# Altium schematic sheet Offset.V03.R00.SchDoc: Agregado de Offset a Canal X
size A4; SheetNumber: 7; SheetTotal: 18
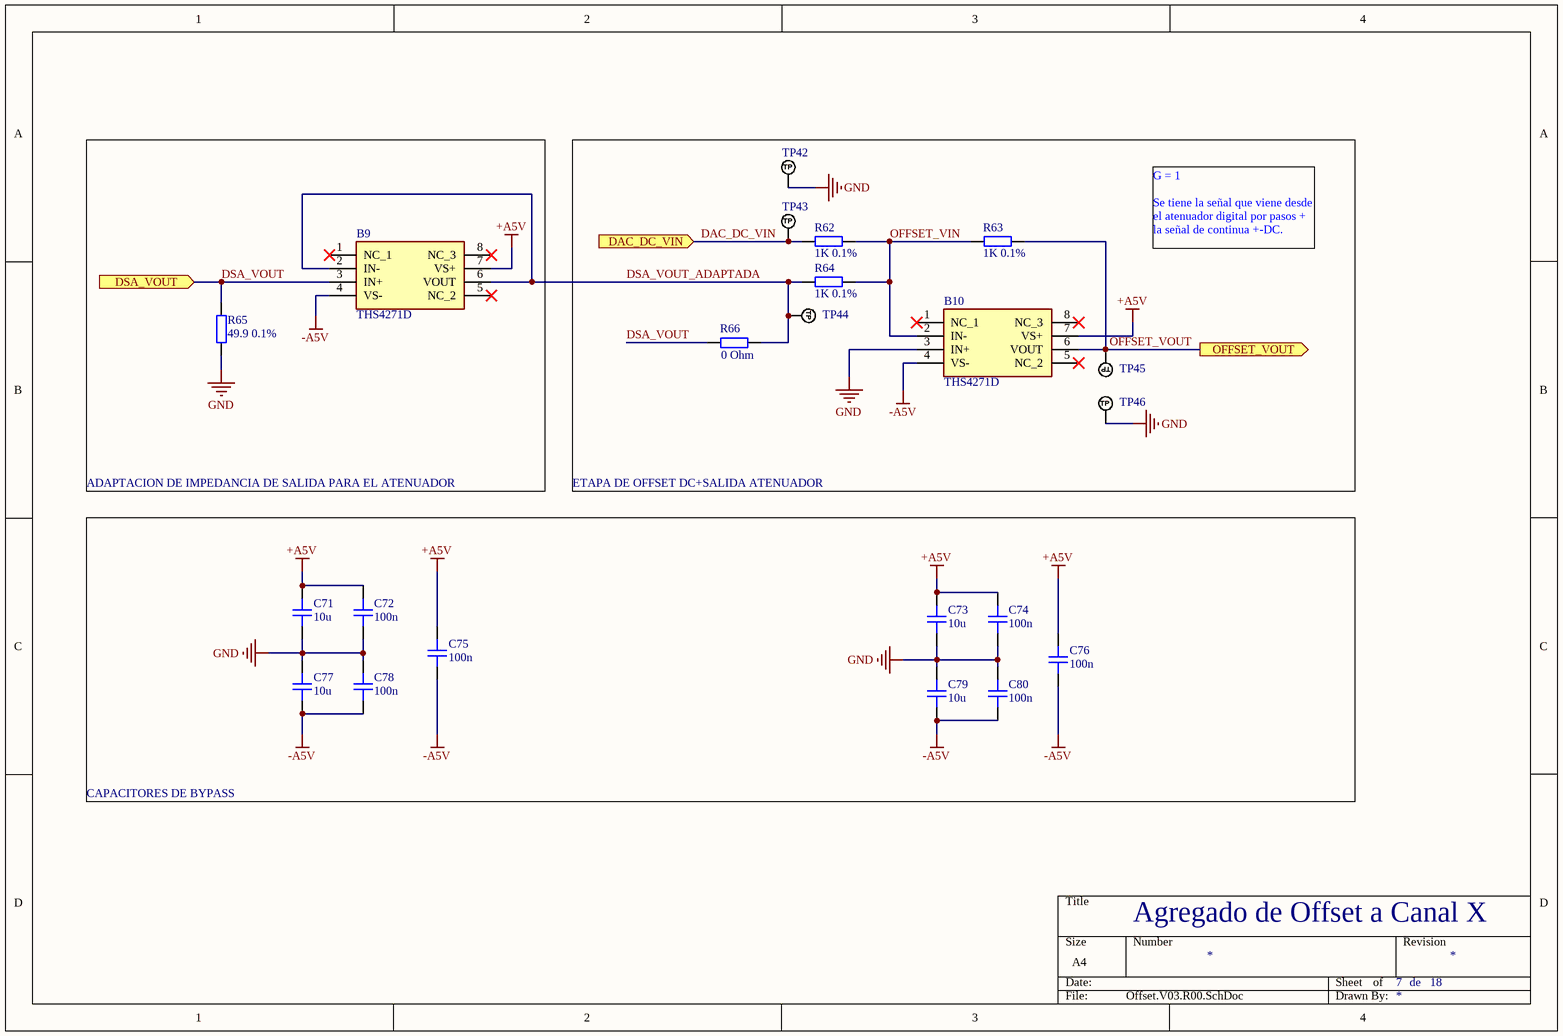
[diagram p0: Offset.V03.R00.SchDoc]

## Parts
B9  THS4271D  [SOIC127P600X175-8N]
B10  THS4271D  [SOIC127P600X175-8N]
C71  10u  [CAP_0805]
C72  100n  [CAP_0805]
C73  10u  [CAP_0805]
C74  100n  [CAP_0805]
C75  100n  [CAP_0805]
C76  100n  [CAP_0805]
C77  10u  [CAP_0805]
C78  100n  [CAP_0805]
C79  10u  [CAP_0805]
C80  100n  [CAP_0805]
R62  1K 0.1%  [RES_0805]
R63  1K 0.1%  [RES_0805]
R64  1K 0.1%  [RES_0805]
R65  49.9 0.1%  [RES_0805]
R66  0 Ohm  [RES_0805]
TP42  TP_NOBOM  [PAD_RND_1MM]  (value not drawn)  (no BOM)
TP43  TP_NOBOM  [PAD_RND_1MM]  (value not drawn)  (no BOM)
TP44  TP_NOBOM  [PAD_RND_1MM]  (value not drawn)  (no BOM)
TP45  TP_NOBOM  [PAD_RND_1MM]  (value not drawn)  (no BOM)
TP46  TP_NOBOM  [PAD_RND_1MM]  (value not drawn)  (no BOM)

## Blocks framed on the sheet
ADAPTACION DE IMPEDANCIA DE SALIDA PARA EL ATENUADOR: B9 R65
ETAPA DE OFFSET DC+SALIDA ATENUADOR: B10 R62-R64 R66 TP42-TP46
CAPACITORES DE BYPASS: C71-C80

## Ports
DAC_DC_VIN (in), DSA_VOUT (in), OFFSET_VOUT (out)

## Nets
+A5V: B9.7(VS+) B10.7(VS+) C71.2 C72.2 C73.2 C74.2 C75.2 C76.2
-A5V: B9.4(VS-) B10.4(VS-) C75.1 C76.1 C77.1 C78.1 C79.1 C80.1
GND: B10.3(IN+) C71.1 C72.1 C73.1 C74.1 C77.2 C78.2 C79.2 C80.2 R65.1 TP42.1(TP) TP46.1(TP)
DAC_DC_VIN: R62.1 TP43.1(TP) ; port DAC_DC_VIN
DSA_VOUT: B9.3(IN+) R65.2 R66.1 ; port DSA_VOUT
DSA_VOUT_ADAPTADA: B9.2(IN-) B9.6(VOUT) R64.1 R66.2 TP44.1(TP)
OFFSET_VIN: B10.2(IN-) R62.2 R63.1 R64.2
OFFSET_VOUT: B10.6(VOUT) R63.2 TP45.1(TP) ; port OFFSET_VOUT

Not connected (* = marked no-connect by the designer): B9 1(NC_1)* 5(NC_2)* 8(NC_3)*; B10 1(NC_1)* 5(NC_2)* 8(NC_3)*

## Notes on the sheet
- G = 1
  Se tiene la señal que viene desde el atenuador digital por pasos + la señal de continua +-DC.
- de

## Library data of the parts
B9 B10 = THS4271D: Super-Fast Ultra-Low Distortion High Speed Amplifier; Manufacturer_Name: Texas Instruments; Geometry.Height: 1.75mm; Mouser Part Number: 595-THS4271D; Mouser Price/Stock: https://www.mouser.co.uk/ProductDetail/Texas-Instruments/THS4271D?qs=ZmJdcv7QZ9ppdaigv2fizw%3D%3D; Manufacturer_Part_Number: THS4271D; Datasheet Link: http://www.ti.com/lit/ds/symlink/ths4271.pdf
C71-C80 = CAP_0805: Capacitor SMD 0805; Manufacturer: *; Manufacturer Part Number: *; Distributor Link: *; LCSC: *; Rating: *; Dielectric: *
R62-R66 = RES_0805: Resistor SMD 0805; Manufacturer: *; Manufacturer Part Number: *; Distributor Link: *; LCSC: *
TP42-TP46 = TEST_POINT_RND_1MM: Test Point Round 1mm (NO BOM)